# Altium project Telephone.PrjPcb (part 2 of 6)
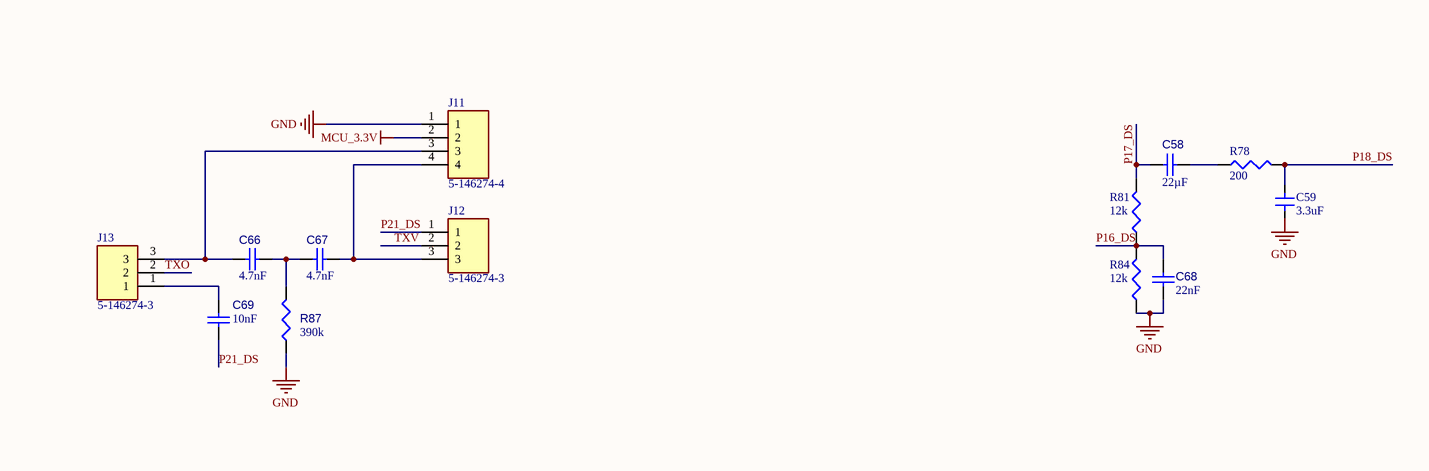
[diagram p14: Telephone.SchDoc, bottom right]

## Sheet Telephone.SchDoc (continued)
### Library data of the parts
C19 C41-C43 C50 = CMP-001-00187-1: ALU Electrolytic; SMD; EEV; +105°C; 16VDC; 6.3µF; 6.3 x 5.4; Manufacturer: KEMET; Manufacturer Part Number: EEV107M016S9GAA; RoHS: Yes; Category: Aluminum Electrolytic Capacitors; Stock 1: 216169; Pricing 1: 1=0.46, 10=0.317, 50=0.223, 100=0.191, 1000=0.12, 10000=0.095 (USD); RoHS Compliant: No; Design Item ID: EEV107M016S9GAA; Component Type: Standard; Pin Count: 2; Source: V4-TEL.SCHLIB
C20 C23 C54 = CMP-001-00121-2: Capacitor 10 uF 35 VDC 1210, GRM32ER7YA106KA12L, Murata; Voltage Rating: 35V; Tolerance: 10%; Dielectric: X7R; Material: Ceramic; Case/Package: 1210; RoHS Compliant: Yes; Min Operating Temperature: -55°C; Max Operating Temperature: 125°C; Design Item ID: GRM32ER7YA106KA12L; Case Code (Metric): 3225; Category: Ceramic Capacitors; Construction: Flat; Depth: 2.5mm; Height: 2.5mm; Lead Free: Lead Free; Length: 3.2mm; Manufacturer 1: Murata; Manufacturer Part Number 1: GRM32ER7YA106KA12L; Mount: Surface Mount; Package Quantity: 1; Packaging: Tape and Reel; Pricing 1: 1=0.96000, 10=0.72800, 50=0.60520, 100=0.52110, 500=0.40344 (USD); Radiation Hardening: No; REACH SVHC: No SVHC; RoHS: Yes; Series: GRM; Source: PTZLib.SchLib; Termination: SMD/SMT; Thickness: 0.106inch; Voltage: 35V; Voltage Rating (DC): 35V; Width: 2.5mm; ComponentLink1Description: https://datasheet.ciiva.com/22782/1747495-22782197.pdf?src-supplier=Farnell; ComponentLink1URL: https://datasheet.ciiva.com/22782/1747495-22782197.pdf?src-supplier=Farnell; ComponentLink2Description: https://datasheet.ciiva.com/3777/grm32er7ya106ka1223-3777248.pdf?src-supplier=Arrow+Electronics; ComponentLink2URL: https://datasheet.ciiva.com/3777/grm32er7ya106ka1223-3777248.pdf?src-supplier=Arrow+Electronics; ComponentLink3Description: https://datasheet.ciiva.com/11789/0900766b80ef921d-11789082.pdf?src-supplier=RSComponents; ComponentLink3URL: https://datasheet.ciiva.com/11789/0900766b80ef921d-11789082.pdf?src-supplier=RSComponents; ComponentLink4Description: https://datasheet.ciiva.com/29199/455226-da-01-en-vs-kondensator-1210-29199348.pdf?src-supplier=Conrad; ComponentLink4URL: https://datasheet.ciiva.com/29199/455226-da-01-en-vs-kondensator-1210-29199348.pdf?src-supplier=Conrad; ComponentLink5Description: https://datasheet.ciiva.com/29202/451166-da-01-de-vs-chip-kond-1210-10-0-uf-10pr-35-0v-x7r-29202478.pdf?src-supplier=Conrad; ComponentLink5URL: https://datasheet.ciiva.com/29202/451166-da-01-de-vs-chip-kond-1210-10-0-uf-10pr-35-0v-x7r-29202478.pdf?src-supplier=Conrad; ComponentLink6Description: https://datasheet.ciiva.com/143/partnumbering-e-01-143241.pdf?src-supplier=Digi-Key; ComponentLink6URL: https://datasheet.ciiva.com/143/partnumbering-e-01-143241.pdf?src-supplier=Digi-Key; ComponentLink7Description: https://datasheet.ciiva.com/143/partnumbering-e-01-143242.pdf?src-supplier=Digi-Key; ComponentLink7URL: https://datasheet.ciiva.com/143/partnumbering-e-01-143242.pdf?src-supplier=Digi-Key; ComponentLink8Description: https://datasheet.ciiva.com/11607/product-11607514.pdf?src-supplier=Avnet; ComponentLink8URL: https://datasheet.ciiva.com/11607/product-11607514.pdf?src-supplier=Avnet; ComponentLink9Description: https://datasheet.ciiva.com/14116/grmseries-highdielectrictype-eng-14116380.pdf?src-supplier=Distrelec; ComponentLink9URL: https://datasheet.ciiva.com/14116/grmseries-highdielectrictype-eng-14116380.pdf?src-supplier=Distrelec; ComponentLink10Description: https://datasheet.ciiva.com/7937/1747495-7937786.pdf?src-supplier=Element14; ComponentLink10URL: https://datasheet.ciiva.com/7937/1747495-7937786.pdf?src-supplier=Element14
C21 = CMP-001-00174-1: Smd Aluminium Electrolytic Capacitor, Wcap-Asli Series, 220 F, 6.3 V, Radial Can - Smd, 6.3 Mm Rohs Compliant: Yes; Manufacturer: Wurth Electronics; Manufacturer Part Number: 865080143009; Voltage Rating: 6.3V; Ripple Current: 240mA; Impedance: 480mR; Tolerance: 20%; RoHS: Yes; Category: Aluminum Electrolytic Capacitors; Stock 1: 1045; Pricing 1: 1=0.28, 10=0.277, 50=0.237, 100=0.207, 1000=0.152, 10000=0.151 (USD); Mount: Surface Mount; Case/Package: Radial; Min Operating Temperature: -55°C; Max Operating Temperature: 105°C; Package Quantity: 1000; Packaging: Cut Tape; Ripple Current (AC): 240mA; Voltage Rating (DC): 6.3V; Series: WCAP-ASLI; Diameter: 6.3mm; Height: 5.5mm; Height - Seated (Max): 0.217inch; RoHS Compliant: Yes; Reach SVHC Compliant: Unknown; ComponentLink1URL: http://www.farnell.com/datasheets/1880092.pdf?src-supplier=Farnell; ComponentLink1Description: http://www.farnell.com/datasheets/1880092.pdf?src-supplier=Farnell; ComponentLink2URL: http://www.farnell.com/datasheets/1880092.pdf?src-supplier=Element14; ComponentLink2Description: http://www.farnell.com/datasheets/1880092.pdf?src-supplier=Element14; ComponentLink3URL: http://www.farnell.com/datasheets/1880092.pdf?src-supplier=Newark; ComponentLink3Description: http://www.farnell.com/datasheets/1880092.pdf?src-supplier=Newark; ComponentLink4URL: https://katalog.we-online.de/pbs/datasheet/865080143009.pdf?src-supplier=Digi-Key; ComponentLink4Description: https://katalog.we-online.de/pbs/datasheet/865080143009.pdf?src-supplier=Digi-Key; ComponentLink5URL: http://katalog.we-online.de/pbs/datasheet/865080143009.pdf?src-supplier=Digi-Key; ComponentLink5Description: http://katalog.we-online.de/pbs/datasheet/865080143009.pdf?src-supplier=Digi-Key; Design Item ID: 865080143009; Component Type: Standard; Pin Count: 2; Source: V4-TEL.SCHLIB
C22 C24 C27 C28 C34 C60 C61 = CMP-001-00108-2: YAGEO - CC0603KRX7R8BB104 - CERAMIC CAPACITOR, 0.1UF, 25V, X7R, 10%, 0603, FULL REEL; Case/Package: 0603; Pins: 2; RoHS Compliant: Yes; Min Operating Temperature: -55°C; Max Operating Temperature: 125°C; Voltage Rating: 25V; Tolerance: 10%; Design Item ID: CC0603KRX7R8BB104; Case Code (Metric): 1608; Category: Ceramic Capacitors; Depth: 0.8mm; Dielectric: X7R; Halogen Free: Halogen Free; Height: 0.8mm; Lead Free: Lead Free; Length: 1.6mm; Manufacturer 1: Yageo; Manufacturer Part Number 1: CC0603KRX7R8BB104; Mount: Surface Mount; Package Quantity: 1; Packaging: Tape and Reel; Pricing 1: 1=0.10000, 10=0.05000, 50=0.02720, 100=0.02220, 500=0.01586, 1000=0.01246 (USD); Radiation Hardening: No; REACH SVHC: Unknown; Resistor Type: Ceramic; RoHS: Yes; Series: CC; Source: PTZLib.SchLib; Stock 1: 4053185; Termination: SMD/SMT; Thickness: 0.035inch; Voltage: 25V; Voltage Rating (DC): 25V; Width: 0.8mm; ComponentLink1Description: https://datasheet.ciiva.com/144/mlccorderingcode-144075.pdf?src-supplier=Digi-Key; ComponentLink1URL: https://datasheet.ciiva.com/144/mlccorderingcode-144075.pdf?src-supplier=Digi-Key; ComponentLink2Description: https://datasheet.ciiva.com/11786/0900766b80c10176-11786120.pdf?src-supplier=RSComponents; ComponentLink2URL: https://datasheet.ciiva.com/11786/0900766b80c10176-11786120.pdf?src-supplier=RSComponents; ComponentLink3Description: https://datasheet.ciiva.com/7978/1489800-7978155.pdf?src-supplier=Element14; ComponentLink3URL: https://datasheet.ciiva.com/7978/1489800-7978155.pdf?src-supplier=Element14; ComponentLink4Description: https://datasheet.ciiva.com/28450/1489800-28450584.pdf?src-supplier=Element14; ComponentLink4URL: https://datasheet.ciiva.com/28450/1489800-28450584.pdf?src-supplier=Element14; ComponentLink5Description: https://datasheet.ciiva.com/144/mlccorderingcode-144074.pdf?src-supplier=Digi-Key; ComponentLink5URL: https://datasheet.ciiva.com/144/mlccorderingcode-144074.pdf?src-supplier=Digi-Key; ComponentLink6Description: https://datasheet.ciiva.com/144/mlccorderingcode-144073.pdf?src-supplier=Digi-Key; ComponentLink6URL: https://datasheet.ciiva.com/144/mlccorderingcode-144073.pdf?src-supplier=Digi-Key; ComponentLink7Description: https://datasheet.ciiva.com/13389/upy-gphc-x7r-6-3v-to-50v-8-13389352.pdf?src-supplier=Mouser; ComponentLink7URL: https://datasheet.ciiva.com/13389/upy-gphc-x7r-6-3v-to-50v-8-13389352.pdf?src-supplier=Mouser; ComponentLink8Description: https://datasheet.ciiva.com/11587/upy-gphc-x7r-6-3v-to-50v-8-11587208.pdf?src-supplier=Avnet; ComponentLink8URL: https://datasheet.ciiva.com/11587/upy-gphc-x7r-6-3v-to-50v-8-11587208.pdf?src-supplier=Avnet; ComponentLink9Description: https://datasheet.ciiva.com/26829/getdatasheetpartid-403577-26829431.pdf?src-supplier=Verical; ComponentLink9URL: https://datasheet.ciiva.com/26829/getdatasheetpartid-403577-26829431.pdf?src-supplier=Verical; ComponentLink10Description: https://datasheet.ciiva.com/17434/upy-gphc-x7r-6-3v-to-50v-8-17434263.pdf?src-supplier=Avnet+Europe; ComponentLink10URL: https://datasheet.ciiva.com/17434/upy-gphc-x7r-6-3v-to-50v-8-17434263.pdf?src-supplier=Avnet+Europe
C25 = CMP-001-00170-1: Chip Capacitor 0805 MLCC X7R 0.033 uF+/ -20% 100 V T&R MH; Manufacturer: Walsin Technologies; Manufacturer Part Number: 0805B333M101CT; Tolerance: 20%; RoHS: Yes; Category: Ceramic Capacitors; Stock 1: 197; Pricing 1: 1=0.11, 10=0.082, 50=0.082, 100=0.039, 1000=0.023, 10000=0.016 (USD); Case/Package: 0805; Min Operating Temperature: -55°C; Max Operating Temperature: 125°C; Packaging: Tape and Reel; Dielectric: X7R; Length: 2mm; Depth: 1.25mm; RoHS Compliant: Yes; Design Item ID: 0805B333M101CT; Component Type: Standard; Pin Count: 2; Source: V4-TEL.SCHLIB
C26 = CMP-001-00194-1: 0603 820 nF 16 V ±10 % Tolerance X7R SMT Multilayer Ceramic Capacitor; Manufacturer: Yageo; Manufacturer Part Number: CC0603KRX7R8BB104; Voltage Rating: 16V; Tolerance: 10%; Case/Package: 0603; Pins: 2; RoHS Compliant: Yes; Min Operating Temperature: -55°C; Max Operating Temperature: 125°C; Case Code (Metric): 1608; Category: Ceramic Capacitors; Depth: 0.8mm; Dielectric: X7R; Halogen Free: Halogen Free; Height: 0.8mm; Lead Free: Lead Free; Length: 1.6mm; Package Quantity: 1; Packaging: Tape and Reel; Radiation Hardening: No; REACH SVHC: Unknown; Resistor Type: Ceramic; RoHS: Yes; Series: CC; Termination: SMD/SMT; Thickness: 0.035inch; Voltage: 16V; Voltage Rating (DC): 16V; Width: 0.8mm; Mounting Technology: Surface Mount; Case Code (Imperial): 0603; Construction: Flat; Dielectric Material: Ceramic; Weight: 7.1E-05oz
C29 C32 C35 C36 = CMP-001-00169-1: Multilayer Ceramic Capacitor, 0.015 F, 10%, X7R, 50 V, 0805 [2012 Metric] RoHS Compliant: Yes; Manufacturer: Walsin Technologies; Manufacturer Part Number: 0805B153K500CT; Voltage Rating: 50V; RoHS: Yes; Category: Ceramic Capacitors; Stock 1: 4000; Pricing 1: 1=0.1, 10=0.071, 50=0.071, 100=0.032, 1000=0.019, 10000=0.016 (USD); Case/Package: 0805; Case Code (Metric): 2012; Min Operating Temperature: -55°C; Max Operating Temperature: 125°C; Tolerance: 10%; Packaging: Tape and Reel; Dielectric: X7R; Voltage Rating (DC): 50V; Length: 2mm; Depth: 1.25mm; Radiation Hardening: No; RoHS Compliant: Yes; Reach SVHC Compliant: Unknown; ComponentLink1URL: https://datasheet.ciiva.com/26831/getdatasheetpartid-415808-26831383.pdf?src-supplier=Verical; ComponentLink1Description: https://datasheet.ciiva.com/26831/getdatasheetpartid-415808-26831383.pdf?src-supplier=Verical; Design Item ID: 0805B153K500CT; Component Type: Standard; Pin Count: 2; Source: V4-TEL.SCHLIB
C30 C49 = Cap_1uF_25V_0603: Cap_1uF_10%_X5R_25V_0603; Manufacturer: Samsung; MFR PART NO: CL10A105KA8NNNC
C31 C33 C52 C69 = CMP-001-00096-2: 0603 10nF 50 V ±10 % Tolerance X7R Surface Mount Multilayer Ceramic Capacitor; Manufacturer: Kyocera AVX; Voltage Rating: 50V; Tolerance: 10%; Dissipation Factor: 2.5%; Insulation Resistance: 100GR; Case/Package: 0603; Pins: 2; Min Operating Temperature: -55°C; Max Operating Temperature: 125°C; Design Item ID: 06035C103KAT2A; Case Code (Metric): 1608; Category: Ceramic Capacitors; Contact Plating: Tin,Matte; Depth: 0.81mm; Dielectric: X7R; Dielectric Material: Ceramic; Height: 0.9mm; Lead Free: Lead Free; Length: 1.6mm; Manufacturer Part Number: 06035C103KAT2A; Mount: Surface Mount,PCB; Packaging: Tape and Reel; Radiation Hardening: No; REACH SVHC: No SVHC; RoHS: Yes; Stock 1: 4334081; Termination: SMD/SMT; Thickness: 0.035inch; Voltage: 50V; Voltage Rating (DC): 50V; Width: 0.032inch; ComponentLink1Description: https://datasheet.ciiva.com/2987/cx7r-2987824.pdf?src-supplier=Avnet; ComponentLink1URL: https://datasheet.ciiva.com/2987/cx7r-2987824.pdf?src-supplier=Avnet; ComponentLink2Description: https://datasheet.ciiva.com/1124/1679506-1124848.pdf?src-supplier=Element14; ComponentLink2URL: https://datasheet.ciiva.com/1124/1679506-1124848.pdf?src-supplier=Element14; ComponentLink3Description: https://datasheet.ciiva.com/7855/1679506-7855082.pdf?src-supplier=Element14; ComponentLink3URL: https://datasheet.ciiva.com/7855/1679506-7855082.pdf?src-supplier=Element14; ComponentLink4Description: https://datasheet.ciiva.com/150/cx7r-150227.pdf?src-supplier=Digi-Key; ComponentLink4URL: https://datasheet.ciiva.com/150/cx7r-150227.pdf?src-supplier=Digi-Key; ComponentLink5Description: https://datasheet.ciiva.com/150/cx7r-150229.pdf?src-supplier=Digi-Key; ComponentLink5URL: https://datasheet.ciiva.com/150/cx7r-150229.pdf?src-supplier=Digi-Key
C37 = CMP-001-00172-2: Cap Cer 0.68UF 250V X7R 1812; Manufacturer: Walsin Technologies; Manufacturer Part Number: 1812B684M251CT; ComponentLink1URL: https://datasheet.octopart.com/1812B684M251CT-Walsin-Technologies-datasheet-136533367.pdf?src-supplier=TECHDesign; ComponentLink1Description: https://datasheet.octopart.com/1812B684M251CT-Walsin-Technologies-datasheet-136533367.pdf?src-supplier=TECHDesign; ComponentLink2URL: https://datasheet.octopart.com/1812B684M251CT-Walsin-Technologies-datasheet-26371553.pdf; ComponentLink2Description: https://datasheet.octopart.com/1812B684M251CT-Walsin-Technologies-datasheet-26371553.pdf; Pins: 2; Voltage Rating: 250V
C38 C68 = CMP-001-00104-2: Cap Ceramic 0.022uF 50V X7R 5% SMD 0603 150C Paper T/R; Manufacturer 1: Vishay Vitramon; Case/Package: 0603; RoHS Compliant: Yes; Min Operating Temperature: -55°C; Max Operating Temperature: 150°C; Tolerance: 5%; Design Item ID: VJ0603Y223JXAAC; Category: Ceramic Capacitors; Construction: Flat; Depth: 0.8mm; Dielectric: X7R; Length: 1.6mm; Manufacturer Part Number 1: VJ0603Y223JXAAC; Packaging: Tape and Reel; Radiation Hardening: No; RoHS: Yes; Voltage Rating (DC): 50V; ComponentLink1Description: http://components.arrow.com/part/dataview/0323_01552007?src-supplier=Arrow+Europe; ComponentLink1URL: http://components.arrow.com/part/dataview/0323_01552007?src-supplier=Arrow+Europe; ComponentLink2Description: http://www.vishay.com/docs/45199/vjcommercialseries.pdf?src-supplier=Digi-Key; ComponentLink2URL: http://www.vishay.com/docs/45199/vjcommercialseries.pdf?src-supplier=Digi-Key; ComponentLink3Description: http://www.vishay.com/docs/45199/commseri.pdf?src-supplier=Avnet; ComponentLink3URL: http://www.vishay.com/docs/45199/commseri.pdf?src-supplier=Avnet; ComponentLink4Description: http://www.vishay.com/docs/45199/commseri.pdf?src-supplier=Avnet+Europe; ComponentLink4URL: http://www.vishay.com/docs/45199/commseri.pdf?src-supplier=Avnet+Europe; Mounting Technology: Surface Mount; Pins: 2
C39 = CMP-001-00184-1: Surface Mount Ceramic Multilayer Capacitor 0.022uF 10% X7R 100V 0805 Paper T/R; Manufacturer: Yageo; Manufacturer Part Number: CC0805KRX7R0BB223; RoHS: Yes; Category: Ceramic Capacitors; Stock 1: 33056; Pricing 1: 1=0.1, 10=0.041, 50=0.041, 100=0.024, 1000=0.02, 10000=0.012 (USD); Mount: Surface Mount; Case/Package: 0805; Case Code (Metric): 2012; Weight: 0.000194oz; Min Operating Temperature: -55°C; Max Operating Temperature: 125°C; Packaging: Tape and Reel; Package Quantity: 1; Tolerance: 10%; Voltage Rating: 100V; Dielectric: X7R; Voltage Rating (DC): 100V; Termination: SMD/SMT; Voltage: 100V; Series: CC; Length: 2mm; Width: 0.049inch; Height: 0.85mm; Thickness: 0.037inch; Depth: 1.25mm; Radiation Hardening: No; Lead Free: Lead Free; RoHS Compliant: Yes; Reach SVHC Compliant: Unknown; ComponentLink1URL: https://datasheet.ciiva.com/25613/0900766b80528518-25613134.pdf?src-supplier=Rs; ComponentLink1Description: https://datasheet.ciiva.com/25613/0900766b80528518-25613134.pdf?src-supplier=Rs; ComponentLink2URL: https://datasheet.ciiva.com/11786/0900766b80d84f7f-11786064.pdf?src-supplier=Rs; ComponentLink2Description: https://datasheet.ciiva.com/11786/0900766b80d84f7f-11786064.pdf?src-supplier=Rs; ComponentLink3URL: https://datasheet.ciiva.com/7978/1447671-7978202.pdf?src-supplier=Element14; ComponentLink3Description: https://datasheet.ciiva.com/7978/1447671-7978202.pdf?src-supplier=Element14; ComponentLink4URL: https://datasheet.ciiva.com/176/mlccorderingcode-176941.pdf?src-supplier=Digi-Key; ComponentLink4Description: https://datasheet.ciiva.com/176/mlccorderingcode-176941.pdf?src-supplier=Digi-Key; ComponentLink5URL: https://datasheet.ciiva.com/176/mlccorderingcode-176940.pdf?src-supplier=Digi-Key; ComponentLink5Description: https://datasheet.ciiva.com/176/mlccorderingcode-176940.pdf?src-supplier=Digi-Key; ComponentLink6URL: https://datasheet.ciiva.com/176/mlccorderingcode-176942.pdf?src-supplier=Digi-Key; ComponentLink6Description: https://datasheet.ciiva.com/176/mlccorderingcode-176942.pdf?src-supplier=Digi-Key; ComponentLink7URL: https://datasheet.ciiva.com/11465/upy-np0x7r-mv-100-to-630v-9-11465277.pdf?src-supplier=Avnet; ComponentLink7Description: https://datasheet.ciiva.com/11465/upy-np0x7r-mv-100-to-630v-9-11465277.pdf?src-supplier=Avnet; ComponentLink8URL: https://datasheet.ciiva.com/17033/upy-np0x7r-mv-100-to-630v-9-17033259.pdf?src-supplier=Future+Electronics; ComponentLink8Description: https://datasheet.ciiva.com/17033/upy-np0x7r-mv-100-to-630v-9-17033259.pdf?src-supplier=Future+Electronics; ComponentLink9URL: https://datasheet.ciiva.com/26829/getdatasheetpartid-251804-26829547.pdf?src-supplier=Verical; ComponentLink9Description: https://datasheet.ciiva.com/26829/getdatasheetpartid-251804-26829547.pdf?src-supplier=Verical; Design Item ID: CC0805KRX7R0BB223; Component Type: Standard; Pin Count: 2; Source: V4-TEL.SCHLIB
C40 = CMP-001-00185-1: ALU Electrolytic; SMD; EDH; +105°C; 6.3VDC; 8µF; 8 x 10.2; Manufacturer: KEMET; Manufacturer Part Number: EDH477M6R3A9MAA; RoHS: Yes; Category: Aluminum Electrolytic Capacitors; Stock 1: 2806; Pricing 1: 1=0.64, 10=0.454, 50=0.343, 100=0.299, 1000=0.221, 10000=0.221 (USD); RoHS Compliant: No; Design Item ID: EDH477M6R3A9MAA; Component Type: Standard; Pin Count: 2; Source: V4-TEL.SCHLIB
C44-C46 C62-C65 = CMP-001-00177-2: Cap, 1000PF, 250V, 10%, X7R, 0603; Manufacturer: Wurth Electronics; Case/Package: 0603; Min Operating Temperature: -55°C; Max Operating Temperature: 125°C; Voltage Rating: 250V; Tolerance: 10%; Design Item ID: 885342206003; Case Code (Metric): 1608; Category: Ceramic Capacitors; Component Type: Standard; Manufacturer Part Number: 885342206003; Mount: Surface Mount; Packaging: Cut Tape; Pin Count: 2; Pricing 1: 1=0.1, 10=0.069, 50=0.069, 100=0.062, 1000=0.055, 10000=0.042 (USD); RoHS: No; Series: WCAP-CSMH; Source: V4-TEL.SCHLIB; Stock 1: 14686; ComponentLink1Description: http://www.farnell.com/datasheets/2547029.pdf?src-supplier=Farnell; ComponentLink1URL: http://www.farnell.com/datasheets/2547029.pdf?src-supplier=Farnell; ComponentLink2Description: http://www.farnell.com/datasheets/2547029.pdf?src-supplier=Newark; ComponentLink2URL: http://www.farnell.com/datasheets/2547029.pdf?src-supplier=Newark; ComponentLink3Description: https://katalog.we-online.de/pbs/datasheet/885342206003.pdf?src-supplier=Digi-Key; ComponentLink3URL: https://katalog.we-online.de/pbs/datasheet/885342206003.pdf?src-supplier=Digi-Key
C47 C48 C58 = CMP-001-00133-2: Cap Ceramic 22uF 10V X5R 10% SMD 0805 85C T/R; Capacitor Type: Ceramic Capacitors; Case/Package: 0805; Max Operating Temperature: 85°C; Min Operating Temperature: -55°C; Mounting Technology: Surface Mount; Pins: 2; RoHS Compliant: Yes; Tolerance: 10%; Voltage Rating: 10V; Case Code (Imperial): 0805; Case Code (Metric): 2012; Depth: 1.25mm; Dielectric: X5R; Lead Free: Lead Free; Length: 0.079inch; Packaging: Tape and Reel; Radiation Hardening: No; Series: CL; Thickness: 0.037inch; Width: 0.049inch
C51 = CMP-001-00173-1: SMD Aluminium Electrolytic Capacitor, WCAP-ASLI Series, 33 F, 6.3 V, Radial Can - SMD, 4 mm RoHS Compliant: Yes; Manufacturer: Wurth Electronics; Voltage Rating: 6.3V; Ripple Current: 82mA; Impedance: 1.9R; Tolerance: 20%; Manufacturer Part Number: 865080140003; RoHS: Yes; Category: Aluminum Electrolytic Capacitors; Stock 1: 4789; Pricing 1: 1=0.18, 10=0.18, 50=0.169, 100=0.158, 1000=0.102, 10000=0.102 (USD); Mount: Surface Mount; Case/Package: Radial; Min Operating Temperature: -55°C; Max Operating Temperature: 105°C; Package Quantity: 1; Packaging: Cut Tape; Ripple Current (AC): 82mA; Voltage Rating (DC): 6.3V; Series: WCAP-ASLI; Diameter: 4mm; Height: 5.5mm; Height - Seated (Max): 0.217inch; RoHS Compliant: Yes; Reach SVHC Compliant: Unknown; ComponentLink1URL: http://www.farnell.com/datasheets/1880086.pdf?src-supplier=Farnell; ComponentLink1Description: http://www.farnell.com/datasheets/1880086.pdf?src-supplier=Farnell; ComponentLink2URL: http://www.farnell.com/datasheets/1880086.pdf?src-supplier=Element14; ComponentLink2Description: http://www.farnell.com/datasheets/1880086.pdf?src-supplier=Element14; ComponentLink3URL: http://katalog.we-online.de/pbs/datasheet/865080140003.pdf?src-supplier=Digi-Key; ComponentLink3Description: http://katalog.we-online.de/pbs/datasheet/865080140003.pdf?src-supplier=Digi-Key; ComponentLink4URL: https://katalog.we-online.de/pbs/datasheet/865080140003.pdf?src-supplier=Digi-Key; ComponentLink4Description: https://katalog.we-online.de/pbs/datasheet/865080140003.pdf?src-supplier=Digi-Key; Design Item ID: 865080140003; Component Type: Standard; Pin Count: 2; Source: V4-TEL.SCHLIB
C53 = CMP-001-00181-1: Cap Ceramic 0.22uF 50V X7R 10% SMD 0805 125°C Plastic T/R; Manufacturer: KEMET; Manufacturer Part Number: C0805C224K5RAC7210; RoHS: Yes; Category: Ceramic Capacitors; Stock 1: 10097; Pricing 1: 1=0.14, 10=0.094, 50=0.094, 100=0.048, 1000=0.029, 10000=0.022 (USD); Mount: Surface Mount; Case/Package: Ceramic; Dielectric Material: Ceramic; Contact Plating: Tin,Matte; Min Operating Temperature: -55°C; Max Operating Temperature: 125°C; Packaging: Tape and Reel; Tolerance: 10%; Dielectric: X7R; Voltage Rating (DC): 50V; Construction: Flat; Length: 2mm; Depth: 1.25mm; Radiation Hardening: No; RoHS Compliant: Yes; ComponentLink1URL: https://www.verical.com/server-webapp/html/getDatasheet?partID=708051&src-supplier=Verical; ComponentLink1Description: https://www.verical.com/server-webapp/html/getDatasheet?partID=708051&src-supplier=Verical; ComponentLink2URL: http://components.arrow.com/part/dataview/48344387S408465N7429?src-supplier=Arrow+Electronics; ComponentLink2Description: http://components.arrow.com/part/dataview/48344387S408465N7429?src-supplier=Arrow+Electronics; ComponentLink3URL: http://capacitoredge.kemet.com/capedge2/DataSheet?pn=C0805C224K5RAC7210&src-supplier=Avnet; ComponentLink3Description: http://capacitoredge.kemet.com/capedge2/DataSheet?pn=C0805C224K5RAC7210&src-supplier=Avnet; Design Item ID: C0805C224K5RAC7210; Component Type: Standard; Pin Count: 2; Source: V4-TEL.SCHLIB
C55 = CMP-001-00182-1: Manufacturer: KEMET; Manufacturer Part Number: C0805C621K1HACTU; RoHS: Yes; Category: Ceramic Capacitors; Stock 1: 15121; Pricing 1: 1=0.1, 10=0.072, 50=0.072, 100=0.033, 1000=0.019, 10000=0.016 (USD); RoHS Compliant: Yes; Design Item ID: C0805C621K1HACTU; Component Type: Standard; Pin Count: 2; Source: V4-TEL.SCHLIB
C56 = CMP-001-00168-1: Capacitor, Ceramic; 0.1UF; Chip; Case 0805; +/-10%; 50WVDC; SMD; X7R; 2.5% Df; 0.037IN. ,; Manufacturer: Kyocera AVX; Manufacturer Part Number: 08055C104KAT2A; Tolerance: 10%; Voltage Rating (DC): 50V; RoHS: Yes; Category: Ceramic Capacitors; Stock 1: 2002566; Pricing 1: 1=0.1, 10=0.037, 50=0.037, 100=0.022, 1000=0.017, 10000=0.013 (USD); Case/Package: 0805; Case Code (Metric): 2012; Dielectric Material: Ceramic; Weight: 0.001411oz; Min Operating Temperature: -55°C; Max Operating Temperature: 125°C; Packaging: Cut Tape; Dielectric: X7R; Termination: Standard; Package Quantity: 4000; Series: MLCC X7R; Voltage: 50V; Length: 2mm; Width: 1.2mm; Height: 0.5mm; RoHS Compliant: Yes; Lead Free: Lead Free; ComponentLink1URL: https://datasheet.ciiva.com/11786/0900766b802d4698-11786116.pdf?src-supplier=Rs; ComponentLink1Description: https://datasheet.ciiva.com/11786/0900766b802d4698-11786116.pdf?src-supplier=Rs; ComponentLink2URL: https://datasheet.ciiva.com/19475/2009691-19475858.pdf?src-supplier=Jameco; ComponentLink2Description: https://datasheet.ciiva.com/19475/2009691-19475858.pdf?src-supplier=Jameco; ComponentLink3URL: https://datasheet.ciiva.com/2988/cx7r-2988014.pdf?src-supplier=Avnet; ComponentLink3Description: https://datasheet.ciiva.com/2988/cx7r-2988014.pdf?src-supplier=Avnet; ComponentLink4URL: https://datasheet.ciiva.com/16199/cx7r-16199014.pdf?src-supplier=Future+Electronics; ComponentLink4Description: https://datasheet.ciiva.com/16199/cx7r-16199014.pdf?src-supplier=Future+Electronics; ComponentLink5URL: https://datasheet.ciiva.com/11504/cx7r-11504044.pdf?src-supplier=Avnet; ComponentLink5Description: https://datasheet.ciiva.com/11504/cx7r-11504044.pdf?src-supplier=Avnet; ComponentLink6URL: https://datasheet.ciiva.com/150/cx7r-150258.pdf?src-supplier=Digi-Key; ComponentLink6Description: https://datasheet.ciiva.com/150/cx7r-150258.pdf?src-supplier=Digi-Key; ComponentLink7URL: https://datasheet.ciiva.com/150/cx7r-150257.pdf?src-supplier=Digi-Key; ComponentLink7Description: https://datasheet.ciiva.com/150/cx7r-150257.pdf?src-supplier=Digi-Key; ComponentLink8URL: https://datasheet.ciiva.com/150/cx7r-150259.pdf?src-supplier=Digi-Key; ComponentLink8Description: https://datasheet.ciiva.com/150/cx7r-150259.pdf?src-supplier=Digi-Key; ComponentLink9URL: https://datasheet.ciiva.com/7812/cx7r-7812079.pdf?src-supplier=Element14; ComponentLink9Description: https://datasheet.ciiva.com/7812/cx7r-7812079.pdf?src-supplier=Element14; ComponentLink10URL: https://datasheet.ciiva.com/5416/cx7r-5416959.pdf?src-supplier=Mouser; ComponentLink10Description: https://datasheet.ciiva.com/5416/cx7r-5416959.pdf?src-supplier=Mouser; Design Item ID: 08055C104KAT2A; Component Type: Standard; Pin Count: 2; Source: V4-TEL.SCHLIB
C57 = CMP-001-00146-2: 3225 C 10uF Ceramic Multilayer Capacitor; 50 V; +85degC; X7R Dielectric; +/-20%; Manufacturer: KEMET; Voltage Rating: 50V; Tolerance: 20%; Case/Package: 1210; RoHS Compliant: Yes; Min Operating Temperature: -55°C; Max Operating Temperature: 125°C; Design Item ID: C1210C106M5RACTU; Case Code (Metric): 3225; Category: Ceramic Capacitors; Component Type: Standard; Depth: 2.5mm; Dielectric: X7R; Dielectric Material: Ceramic; Height: 2.5mm; Length: 3.2mm; Manufacturer Part Number: C1210C106M5RACTU; Packaging: Tape and Reel; Thickness: 0.11inch; Voltage: 50V; Voltage Rating (DC): 50V; Weight: 0.000564oz; Width: 0.098inch; ComponentLink1Description: http://www.farnell.com/datasheets/2746479.pdf?src-supplier=Farnell; ComponentLink1URL: http://www.farnell.com/datasheets/2746479.pdf?src-supplier=Farnell; ComponentLink2Description: http://uk.rs-online.com/webdocs/1515/0900766b8151523a.pdf?src-supplier=RSComponents; ComponentLink2URL: http://uk.rs-online.com/webdocs/1515/0900766b8151523a.pdf?src-supplier=RSComponents; ComponentLink3Description: http://www.farnell.com/datasheets/2323917.pdf?src-supplier=Farnell; ComponentLink3URL: http://www.farnell.com/datasheets/2323917.pdf?src-supplier=Farnell; ComponentLink4Description: http://www.mouser.com/ds/2/212/KEM_C1002_X7R_SMD-357932.pdf?src-supplier=Mouser; ComponentLink4URL: http://www.mouser.com/ds/2/212/KEM_C1002_X7R_SMD-357932.pdf?src-supplier=Mouser; ComponentLink5Description: http://www.kemet.com/Lists/ProductCatalog/Attachments/53/KEM_C1002_X7R_SMD.pdf?src-supplier=Digi-Key; ComponentLink5URL: http://www.kemet.com/Lists/ProductCatalog/Attachments/53/KEM_C1002_X7R_SMD.pdf?src-supplier=Digi-Key; ComponentLink6Description: http://www.farnell.com/datasheets/2746479.pdf?src-supplier=Newark; ComponentLink6URL: http://www.farnell.com/datasheets/2746479.pdf?src-supplier=Newark; ComponentLink7Description: https://api.kemet.com/component-edge/download/datasheet/C1210C106M5RACTU.pdf?src-supplier=Digi-Key; ComponentLink7URL: https://api.kemet.com/component-edge/download/datasheet/C1210C106M5RACTU.pdf?src-supplier=Digi-Key; Mounting Technology: Surface Mount; Pins: 2
C59 = CMP-001-00165-1: Chip Capacitor 0603 MLCC X5R 3.3 uF+/- 10% 6.3 V T&R GP; Manufacturer: Walsin Technologies; Manufacturer Part Number: 0603X335K6R3CT; RoHS: Yes; Category: Ceramic Capacitors; Stock 1: 7326; Pricing 1: 1=0.2, 10=0.137, 50=0.137, 100=0.069, 1000=0.042, 10000=0.032 (USD); RoHS Compliant: Yes; Design Item ID: 0603X335K6R3CT; Component Type: Standard; Pin Count: 2; Source: V4-TEL.SCHLIB
C66 C67 = CMP-001-00190-1: Cap Ceramic 0.0047uF 50V X7R 10% SMD 0805 125°C Paper T/R; Case/Package: 0805; Dielectric Material: Ceramic; Min Operating Temperature: -55°C; Max Operating Temperature: 125°C; Tolerance: 10%; Dielectric: X7R; Voltage Rating (DC): 50V; Construction: Flat; Length: 2mm; Height: 0.78mm; Depth: 1.25mm; RoHS Compliant: Yes; Mounting Technology: Surface Mount; Pins: 2; Case Code (Imperial): 0805; Case Code (Metric): 2012; Packaging: Tape and Reel; Series: SMD Comm X7R; Termination: SMD/SMT; Weight: 0.000194oz; Width: 1.2mm
D2 D11 = CMP-004-00066-2: Bridge Rectifier Single Phase Standard 1 kV Surface Mount MBF; Manufacturer: Diodes; Forward Current: 800mA; Forward Voltage: 940mV; Max Surge Current: 30A; Peak Inverse Voltage: 1kV; Case/Package: MBF; Pins: 4; Max Operating Temperature: 150°C; Min Operating Temperature: -55°C; Mounting Technology: Surface Mount; Manufacturer Part Number: MB10F-13
D3 = CMP-004-00063-2: MITSUBISHI MATERIALS DSS Series 300V 0.5kA Through Hole Surge Absorber Gas Discharge Tube (GDT); Manufacturer: Mitsubishi; Manufacturer Part Number: DSS-301L; Mount: Through Hole; Length: 7mm; Height: 3.3mm; Design Item ID: DSS-301L; Component Type: Standard; Pins: 2; RoHS Compliant: No
D4 = CMP-004-00069-2: Zener Diodes 10 Volt 1 Watt 5%; Impedance: 7R; Max Power Dissipation: 1W; Max Reverse Leakage Current: 10uA; Zener Voltage: 10V; Case/Package: MELF; Pins: 2; Manufacturer Part Number: ZM4740A_L0G; Max Operating Temperature: 175°C; Min Operating Temperature: -65°C; RoHS Compliant: Yes; Package Quantity: 5000; Packaging: Tape and Reel; Voltage Tolerance: 5%
D5 D6 = CMP-004-00067-1: MURS140 Series 400 V 1 A 75 ns SMT Ultrafast Plastic Rectifier - DO-214AA; Forward Current: 2A; Forward Voltage: 1.25V; Max Surge Current: 35A; Peak Inverse Voltage: 400V; Max Reverse Current: 5uA; Recovery Time: 75ns; Case/Package: SMB; Max Operating Temperature: 175°C; Min Operating Temperature: -65°C; Mounting Technology: Surface Mount; Pins: 2; RoHS Compliant: Yes; Average Rectified Current: 2A; Lead Free: Lead Free; Max Repetitive Reverse Voltage (Vrrm): 400V; Max Reverse Voltage (DC): 400V; Package Quantity: 3200; Packaging: Tape and Reel; Peak Non-Repetitive Surge Current: 35A; Radiation Hardening: No; Reverse Recovery Time: 75ns; Reverse Recovery Time-Max: 75ns; Reverse Voltage: 400V
D7 D8 = CMP-004-00042-3: Si-diode 0, 15A 100V SOD123; Manufacturer: Pan Jit; Reverse Recovery Time: 4ns; Forward Current: 150mA; Peak Non-Repetitive Surge Current: 4A; Element Configuration: Single; Manufacturer Part Number: 1N4148W_R1_00001; Category: Rectifier Diodes; Pricing 1: 1=0.14000, 10=0.13000, 50=0.13000, 100=0.07100, 500=0.04400, 1000=0.03000, 3000=0.02200, 9000=0.01900, 10000=0.01900, 24000=0.01700, 45000=0.01400 (USD); Mount: Surface Mount; Min Operating Temperature: -50°C; Max Operating Temperature: 150°C; Max Repetitive Reverse Voltage (Vrrm): 100V; RoHS Compliant: Yes; ComponentLink1URL: https://datasheet.ciiva.com/8300/1n4148w-8300232.pdf?src-supplier=Avnet; ComponentLink1Description: https://datasheet.ciiva.com/8300/1n4148w-8300232.pdf?src-supplier=Avnet; Design Item ID: 1N4148W_R1_00001; Radiation Hardening: No; Mounting Technology: Surface Mount; Pins: 2
D9 D10 = CMP-004-00062-2: Diode Zener Single 5.1V 2.564% 200mW Automotive 2-Pin SOD-323 T/R; Manufacturer: Diodes; Tolerance: 3%; Impedance: 17R; Max Reverse Leakage Current: 5uA; Test Current: 20mA; Forward Voltage: 900mV; Manufacturer Part Number: DDZ5V1BS-7; RoHS: Yes; Category: Zener Diodes; Pricing 1: 1=0.12, 10=0.101, 50=0.101, 100=0.07, 1000=0.055, 10000=0.033 (USD); Mount: Surface Mount; Case/Package: SOD-323-2; Weight: 0.000173oz; Min Operating Temperature: -65°C; Max Operating Temperature: 150°C; Package Quantity: 3000; Packaging: Tape and Reel; Max Power Dissipation: 200mW; Zener Voltage: 5.1V; Voltage Tolerance: 2.564%; Power Dissipation: 200mW; Zener Current: 5uA; Max Reverse Current: 5uA; Power Rating: 200mW; Length: 2.5mm; Width: 1.3mm; Height: 1.05mm; Radiation Hardening: No; RoHS Compliant: Yes; Pins: 2; Component Type: Standard; Pin Count: 2; Mounting Technology: Surface Mount
D12 = CMP-004-00064-1: On a Reel of 3000, ON Semiconductor, 27V Zener Diode 2% 300 mW SMT 2-Pin SOD-323, RL; Max Power Dissipation: 200mW; Max Reverse Leakage Current: 50nA; Impedance: 80R; Zener Voltage: 26.86V; Test Current: 5mA; Manufacturer: ON Semiconductor; Manufacturer Part Number: MM3Z27VST1G; RoHS: Yes; Category: Zener Diodes; Stock 1: 26808; Pricing 1: 1=0.15, 10=0.126, 50=0.126, 100=0.075, 1000=0.032, 10000=0.02 (USD); Case/Package: SOD-323-2; Min Operating Temperature: -65°C; Max Operating Temperature: 150°C; Package Quantity: 3000; Packaging: Tape and Reel; Power Dissipation: 200mW; Voltage Tolerance: 2%; Length: 1.8mm; Width: 1.35mm; Height: 1mm; Radiation Hardening: No; Lead Free: Lead Free; RoHS Compliant: Yes; ComponentLink1URL: https://datasheet.ciiva.com/10637/mm3z2v4st1-d-10637814.pdf?src-supplier=Avnet; ComponentLink1Description: https://datasheet.ciiva.com/10637/mm3z2v4st1-d-10637814.pdf?src-supplier=Avnet; Pins: 2; Design Item ID: MM3Z27VST1G; Component Type: Standard; Pin Count: 2; Source: V4-TEL.SCHLIB
J3-J10 J12 J13 = CMP-002-00180-2: Conn Unshrouded Header HDR 3 POS 2.54mm Solder ST Top Entry Thru-Hole Carton; Manufacturer: TE Connectivity; Centerline_Pitch: 2.54 mm[.1 in]; Product_Type: Connector; Connector Type: Plug,Header,Pin; Gender: Male; Voltage Rating: 750V; Approvals: CSA; Board Standoff: Yes (With); Contact Current Rating: 3A; Contact Post Length: 0.125inch; Contact Protection: No (Without); High Speed Serial Data Connector: No; High Temperature Housing: Yes; Max Voltage Rating (AC): 250V; Number of Contacts: 3; PCB Mount Retention: Without; PCB Mounting Orientation: Vertical; PCB Thickness: 0.062inch; Case/Package: None; Pins: 3; Design Item ID: 5-146274-3; EU_RoHS_Compliance: Compliant; Manufacturer Part Number: 5-146274-3; Price: None; SnapEDA_Link: https://www.snapeda.com/parts/5-146274-3/TE%20Connectivity%20AMP%20Connectors/view-part/904860/?ref=snap; Source: SnapEDAsch.SchLib; TE_purchase_URL: https://www.te.com/usa-en/product-5-146274-3.html?te_bu=Cor&te_type=disp&te_campaign=seda_glo_cor-seda-global-disp-prtnr-fy19-seda-model-bom-cta_sma-317_1&elqCampaignId=32493; Value: *; Max Operating Temperature: 105°C; Min Operating Temperature: -65°C; Mounting Technology: Through Hole; RoHS Compliant: Yes; Color: Black; Contact Finish - Mating: TIN; Contact Gender: Male; Contact Material: Bronze; Contact Mating Length: 8.08mm; Contact Plating: Tin; Contact Shape: Square; Contact Type: Male Pin; Current Rating: 3A; Depth: 2.34mm; ELV: Compliant; Fastening Type: Pull; Flammability Rating: UL94 V-0; Gasket: No (Without); Housing Color: Black; Housing Material: Polymer; Insulation Color: Black; Insulation Material: Polymer; Keyed: No; Lead Free: Lead Free; Length: 7.21mm; Mating Alignment: No (Without); Mating Connector Lock: No (Without); Number of Positions: 3; Number of Rows: 1; Orientation: Straight; Package Quantity: 540; Packaging: Carton; Pitch: 2.54mm; Radiation Hardening: No; Reach SVHC Compliant: Unknown; Row Spacing: 2.54mm; Selectively Loaded: No (Without); Series: AMPMODU MOD II; Stabilizers: No (Without); Strain Relief: No (Without); Termination: Through Hole
J11 = CMP-002-00185-1: 5-146274-4 ; ROHS ; TYCO ; AMPMODU Breakaway Heade rs 4P HEADER TIN single r ow; Connector Type: Plug,Header,Pin; Approvals: CSA; Board Standoff: Yes (With); Contact Current Rating: 3A; Contact Post Length: 0.125inch; Contact Protection: No (Without); High Speed Serial Data Connector: No; High Temperature Housing: Yes; Max Voltage Rating (AC): 250V; Number of Contacts: 4; PCB Mount Retention: Without; PCB Mounting Orientation: Vertical; PCB Thickness: 0.062inch; Pitch: 2.54mm; Max Operating Temperature: 105°C; Min Operating Temperature: -65°C; Mounting Technology: Through Hole; RoHS Compliant: Yes; Color: Black; Contact Finish - Mating: TIN; Contact Gender: Male; Contact Material: Bronze; Contact Mating Length: 8.08mm; Contact Plating: Tin; Contact Shape: Square; Contact Type: Male Pin; Depth: 2.34mm; ELV: Compliant; Fastening Type: Pull; Flammability Rating: UL94 V-0; Gasket: No (Without); Housing Color: Black; Housing Material: Polymer; Insulation Color: Black; Insulation Material: Polymer; Keyed: No; Length: 9.75mm; Mating Alignment: No (Without); Mating Connector Lock: No (Without); Number of Positions: 4; Number of Rows: 1; Orientation: Straight; Package Quantity: 500; Packaging: Carton; Radiation Hardening: No; Row Spacing: 2.54mm; Selectively Loaded: No (Without); Series: AMPMODU MOD II; Stabilizers: No (Without); Strain Relief: No (Without); Termination: Through Hole
Q4 Q5 = CMP-012-000004-2: MPSA92 Series 300 V 500 mA PNP Through Hole Silicon Transistor - TO-92; Manufacturer: Central Semiconductor; Manufacturer Part Number: MPSA92PBFREE; RoHS: Yes; Stock 1: 81433; Pricing 1: 1=0.51, 10=0.438, 50=0.438, 100=0.327, 1000=0.19, 10000=0.146 (USD); Design Item ID: MPSA92PBFREE; Source: V4-TEL.SCHLIB; Component Type: Standard; Pin Count: 3
Q6 Q9 Q11 Q12 = CMP-013-00035-1: ON Semi BCX17LT1G PNP Bipolar Transistor; 0.5 A; 45 V; 3-Pin SOT-23; Manufacturer: ON Semiconductor; Nominal Vgs: 5V; Continuous Collector Current: 500mA; Case/Package: SOT-23-3; Min Operating Temperature: -55°C; Pins: 3; Max Operating Temperature: 150°C; Mounting Technology: SMD/SMT; Transistor Type: PNP; Manufacturer Part Number: BCX17LT1G
Q7 Q8 Q10 = CMP-012-00011-1: Bipolar Transistor, SOT-23, 160V, 600mA; Manufacturer: ON Semiconductor; Manufacturer Part Number: MMBT5551LT1G; Case/Package: SOT-23; RoHS Compliant: Yes; Reach SVHC Compliant: Yes
R22 = CMP-009-00298-1: Res Thick Film 0805 1.5K Ohm 5% 1/8W ±200ppm/°C Molded SMD SMD Paper T/R; Manufacturer: Vishay Dale; Manufacturer Part Number: CRCW08051K50JNEA; Power Rating: 125mW; Voltage Rating: 150V; RoHS: Yes; Category: Chip SMD Resistors; Stock 1: 18838; Pricing 1: 1=0.1, 10=0.05, 50=0.05, 100=0.021, 1000=0.01, 10000=0.006 (USD); Case/Package: 0805; Weight: 0.000194oz; Case Code (Metric): 2012; Contact Plating: Tin; Size Code: 0805; Min Operating Temperature: -55°C; Max Operating Temperature: 155°C; Tolerance: 5%; Packaging: Tape and Reel; Package Quantity: 5000; Termination: SMD/SMT; Resistor Type: Thick Film; Temperature Coefficient: 200ppm/°C; Voltage Rating (DC): 150V; Features: Automotive AEC-Q200; Series: CRCW; Max Power Dissipation: 125mW; Number of Terminations: 2; Construction: Rectangular; Resistance Tolerance: 5%; Length: 2mm; Width: 1.25mm; Height: 0.45mm; Depth: 1.25mm; Radiation Hardening: No; Military Standard: Not; Lead Free: Lead Free; RoHS Compliant: Yes; Reach SVHC Compliant: Unknown; ComponentLink1URL: https://datasheet.ciiva.com/16780/70201119-16780055.pdf?src-supplier=Allied+Electronics; ComponentLink1Description: https://datasheet.ciiva.com/16780/70201119-16780055.pdf?src-supplier=Allied+Electronics; ComponentLink2URL: https://datasheet.ciiva.com/9100/dcrcwe3-9100360.pdf?src-supplier=Avnet; ComponentLink2Description: https://datasheet.ciiva.com/9100/dcrcwe3-9100360.pdf?src-supplier=Avnet; Design Item ID: CRCW08051K50JNEA; Component Type: Standard; Pin Count: 2; Source: V4-TEL.SCHLIB
R23 R43 = CMP-009-00299-1: Res Thick Film 0805 1.8K Ohm 5% 1/8W ±200ppm/°C Molded SMD SMD Paper T/R; Manufacturer: Vishay Dale; Manufacturer Part Number: CRCW08051K80JNEA; Power Rating: 125mW; Voltage Rating: 150V; RoHS: Yes; Category: Chip SMD Resistors; Stock 1: 4900; Pricing 1: 1=0.1, 10=0.05, 50=0.05, 100=0.021, 1000=0.01, 10000=0.005 (USD); Case/Package: 0805; Contact Plating: Tin; Weight: 0.000194oz; Case Code (Metric): 2012; Size Code: 0805; Min Operating Temperature: -55°C; Max Operating Temperature: 155°C; Tolerance: 5%; Temperature Coefficient: 200ppm/°C; Packaging: Cut Tape; Resistor Type: Thick Film; Number of Terminations: 2; Termination: SMD/SMT; Max Power Dissipation: 125mW; Features: Automotive AEC-Q200; Series: CRCW; Package Quantity: 1; Voltage Rating (DC): 150V; Resistance Tolerance: 5%; Length: 0.079inch; Width: 0.049inch; Height: 0.02inch; Radiation Hardening: No; Lead Free: Lead Free; RoHS Compliant: Yes; Reach SVHC Compliant: Unknown; ComponentLink1URL: https://datasheet.ciiva.com/2464/dcrcwe3-2464848.pdf?src-supplier=Digi-Key; ComponentLink1Description: https://datasheet.ciiva.com/2464/dcrcwe3-2464848.pdf?src-supplier=Digi-Key; ComponentLink2URL: https://datasheet.ciiva.com/22872/70201119-22872346.pdf?src-supplier=Allied+Electronics; ComponentLink2Description: https://datasheet.ciiva.com/22872/70201119-22872346.pdf?src-supplier=Allied+Electronics; ComponentLink3URL: https://datasheet.ciiva.com/16390/dcrcw-16390924.pdf?src-supplier=Future+Electronics; ComponentLink3Description: https://datasheet.ciiva.com/16390/dcrcw-16390924.pdf?src-supplier=Future+Electronics; ComponentLink4URL: https://datasheet.ciiva.com/3258/dcrcwe3-3258269.pdf?src-supplier=Avnet; ComponentLink4Description: https://datasheet.ciiva.com/3258/dcrcwe3-3258269.pdf?src-supplier=Avnet; ComponentLink5URL: https://datasheet.ciiva.com/2464/dcrcwe3-2464846.pdf?src-supplier=Digi-Key; ComponentLink5Description: https://datasheet.ciiva.com/2464/dcrcwe3-2464846.pdf?src-supplier=Digi-Key; ComponentLink6URL: https://datasheet.ciiva.com/3258/dcrcwe3-3258270.pdf?src-supplier=Avnet; ComponentLink6Description: https://datasheet.ciiva.com/3258/dcrcwe3-3258270.pdf?src-supplier=Avnet; ComponentLink7URL: https://datasheet.ciiva.com/2464/dcrcwe3-2464847.pdf?src-supplier=Digi-Key; ComponentLink7Description: https://datasheet.ciiva.com/2464/dcrcwe3-2464847.pdf?src-supplier=Digi-Key; Design Item ID: CRCW08051K80JNEA; Component Type: Standard; Pin Count: 2; Source: V4-TEL.SCHLIB
R24 R70 = CMP-009-00296-1: Res Thick Film 0805 2.2K Ohm 5% 1/8W ±200ppm/°C Molded SMD SMD Paper Tape on Plastic Reel; Manufacturer: Bourns; Manufacturer Part Number: CR0805-JW-222ELF; Power Rating: 125mW; Voltage Rating: 150V; RoHS: Yes; Category: Chip SMD Resistors; Stock 1: 107619; Pricing 1: 1=0.1, 10=0.024, 50=0.024, 100=0.01, 1000=0.005, 10000=0.003 (USD); Mount: Surface Mount; Case/Package: 0805; Case Code (Metric): 2012; Contact Plating: Tin; Min Operating Temperature: -55°C; Max Operating Temperature: 155°C; Packaging: Tape and Reel; Tolerance: 5%; Package Quantity: 1; Resistor Type: Thick Film; Termination: SMD/SMT; Number of Terminations: 2; Temperature Coefficient: 200ppm/°C; Max Power Dissipation: 125mW; Voltage Rating (DC): 150V; Features: Moisture Resistant; Series: CR0805; Resistance Tolerance: 5%; Length: 0.079inch; Width: 1.25mm; Height: 0.024inch; Thickness: 508um; Radiation Hardening: No; Reach SVHC Compliant: No; RoHS Compliant: Yes; ComponentLink1URL: https://datasheet.ciiva.com/5547/chpreztr-26488-5547975.pdf?src-supplier=Mouser; ComponentLink1Description: https://datasheet.ciiva.com/5547/chpreztr-26488-5547975.pdf?src-supplier=Mouser; ComponentLink2URL: https://datasheet.ciiva.com/6547/chpreztr-6547353.pdf?src-supplier=Digi-Key; ComponentLink2Description: https://datasheet.ciiva.com/6547/chpreztr-6547353.pdf?src-supplier=Digi-Key; ComponentLink3URL: https://datasheet.ciiva.com/6547/chpreztr-6547354.pdf?src-supplier=Digi-Key; ComponentLink3Description: https://datasheet.ciiva.com/6547/chpreztr-6547354.pdf?src-supplier=Digi-Key; ComponentLink4URL: https://datasheet.ciiva.com/6547/chpreztr-6547355.pdf?src-supplier=Digi-Key; ComponentLink4Description: https://datasheet.ciiva.com/6547/chpreztr-6547355.pdf?src-supplier=Digi-Key; Design Item ID: CR0805-JW-222ELF; Component Type: Standard; Pin Count: 2; Source: V4-TEL.SCHLIB
R25 R28 R56 R58 R65 R68 R75 R77 R88 = CMP-009-00195-1: Res Thkflm 0603 0 Ohm Jumper 1/10W 100Ppm/ C Smd Rohs Compliant: Yes; Manufacturer 1: Stackpole Electronics; Current Rating: 1A; Max Power Dissipation: 100mW; Working Voltage: 75V; Case/Package: 0603; RoHS Compliant: Yes; Min Operating Temperature: -55°C; Max Operating Temperature: 155°C; Design Item ID: RMCF0603ZT0R00; Case Code (Metric): 1608; Category: Chip SMD Resistors; Construction: Rectangular; Contact Plating: Tin,Matte; Depth: 0.8mm; Features: Automotive AEC-Q200; Height: 0.022inch; Lead Free: Lead Free; Length: 1.55mm; Manufacturer Part Number 1: RMCF0603ZT0R00; Military Standard: Not; Mount: Surface Mount; Number of Terminations: 2; Packaging: Tape and Reel; Power Rating: 100mW; Pricing 1: 1=0.10000, 10=0.01300, 25=0.00960, 50=0.00720, 100=0.00530, 250=0.00404, 500=0.00324, 1000=0.00238 (USD); Radiation Hardening: No; Resistor Type: Thick Film; RoHS: Yes; Series: RMCF; Source: PTZLib.SchLib; Stock 1: 617251; Width: 0.031inch; ComponentLink1Description: https://www.seielect.com/catalog/SEI-Packaging.pdf?src-supplier=Digi-Key; ComponentLink1URL: https://www.seielect.com/catalog/SEI-Packaging.pdf?src-supplier=Digi-Key; ComponentLink2Description: https://www.seielect.com/Catalog/SEI-RMCF_RMCP.pdf?src-supplier=Digi-Key; ComponentLink2URL: https://www.seielect.com/Catalog/SEI-RMCF_RMCP.pdf?src-supplier=Digi-Key; ComponentLink3Description: https://www.seielect.com/catalog/SEI-Packaging.pdf?src-supplier=Arrow+Electronics; ComponentLink3URL: https://www.seielect.com/catalog/SEI-Packaging.pdf?src-supplier=Arrow+Electronics; ComponentLink4Description: https://www.seielect.com/catalog/SEI-Packaging.pdf?src-supplier=Avnet; ComponentLink4URL: https://www.seielect.com/catalog/SEI-Packaging.pdf?src-supplier=Avnet; ComponentLink5Description: https://www.seielect.com/catalog/SEI-Packaging.pdf?src-supplier=Verical; ComponentLink5URL: https://www.seielect.com/catalog/SEI-Packaging.pdf?src-supplier=Verical
R26 R32 = CMP-009-00285-2: Res Thick Film 2512 10 Ohm 5% 3W ±200ppm/C Pad SMD T/R; Manufacturer: TE Connectivity CGS; Temperature Coefficient: 200ppm/°C; Voltage Rating: 250V; Number of Resistors: 1; Manufacturer Part Number: 1-2176230-4; RoHS: Yes; Category: Uncategorized; Stock 1: 23105; Pricing 1: 1=0.73, 10=0.617, 50=0.617, 100=0.414, 1000=0.243, 10000=0.2 (USD); Mount: Surface Mount; Case/Package: 2512; Case Code (Metric): 6432; Min Operating Temperature: -55°C; Max Operating Temperature: 105°C; Packaging: Tape and Reel; Tolerance: 5%; Number of Terminations: 2; Series: 3522; Power Rating: 3W; Termination: Solder; Resistor Type: Thick Film,Power resistor; Voltage Rating (DC): 250V; Technology: THICK FILM; Resistance Tolerance: 5%; Length: 6.35mm; Height: 1.1mm; Depth: 3.2mm; RoHS Compliant: Yes; Reach SVHC Compliant: Unknown; ComponentLink1URL: http://www.farnell.com/datasheets/2007092.pdf?src-supplier=Farnell; ComponentLink1Description: http://www.farnell.com/datasheets/2007092.pdf?src-supplier=Farnell; ComponentLink2URL: http://uk.rs-online.com/webdocs/142d/0900766b8142d0f1.pdf?src-supplier=Rs; ComponentLink2Description: http://uk.rs-online.com/webdocs/142d/0900766b8142d0f1.pdf?src-supplier=Rs; ComponentLink3URL: https://www.te.com/commerce/DocumentDelivery/DDEController?Action=srchrtrv&DocNm=9-1773463-7&DocType=DS&DocLang=English&src-supplier=Digi-Key; ComponentLink3Description: https://www.te.com/commerce/DocumentDelivery/DDEController?Action=srchrtrv&DocNm=9-1773463-7&DocType=DS&DocLang=English&src-supplier=Digi-Key; ComponentLink4URL: http://www.te.com/commerce/DocumentDelivery/DDEController?Action=srchrtrv&DocNm=9-1773463-7&DocType=DS&DocLang=English&src-supplier=Digi-Key; ComponentLink4Description: http://www.te.com/commerce/DocumentDelivery/DDEController?Action=srchrtrv&DocNm=9-1773463-7&DocType=DS&DocLang=English&src-supplier=Digi-Key; ComponentLink5URL: http://www.farnell.com/datasheets/2007092.pdf?src-supplier=Newark; ComponentLink5Description: http://www.farnell.com/datasheets/2007092.pdf?src-supplier=Newark; Design Item ID: 1-2176230-4; Component Type: Standard; Pin Count: 2; Source: V4-TEL.SCHLIB
R27 R44 R52 = CMP-009-00319-1: Res Trimmer 20K Ohm 25% 1/10W 1(Elec)/1(Mech)Turn (3 X 3.8mm) Foot Print SMD Embossed T/R; Power: 100mW; Number of Turns: 1; Temperature Coefficient: 250ppm/°C; RoHS Compliant: Yes; Mounting Technology: Surface Mount; Max Operating Temperature: 100°C; Min Operating Temperature: -40°C; Tolerance: 25%; Pins: 3; Depth: 3.8mm; Height: 0.047inch; Length: 3mm; Max Power Dissipation: 100mW; Military Standard: Not; Package Quantity: 1; Packaging: Tape and Reel; Power Rating: 100mW; Radiation Hardening: No; Reach SVHC Compliant: No; Resistance Tolerance: 25%; Resistor Type: Cermet; Series: TC33; Termination: Foot Print; Width: 0.118inch